# Altium schematic sheet Photography_Light.SchDoc
size A4; SheetNumber: 1; SheetTotal: 1
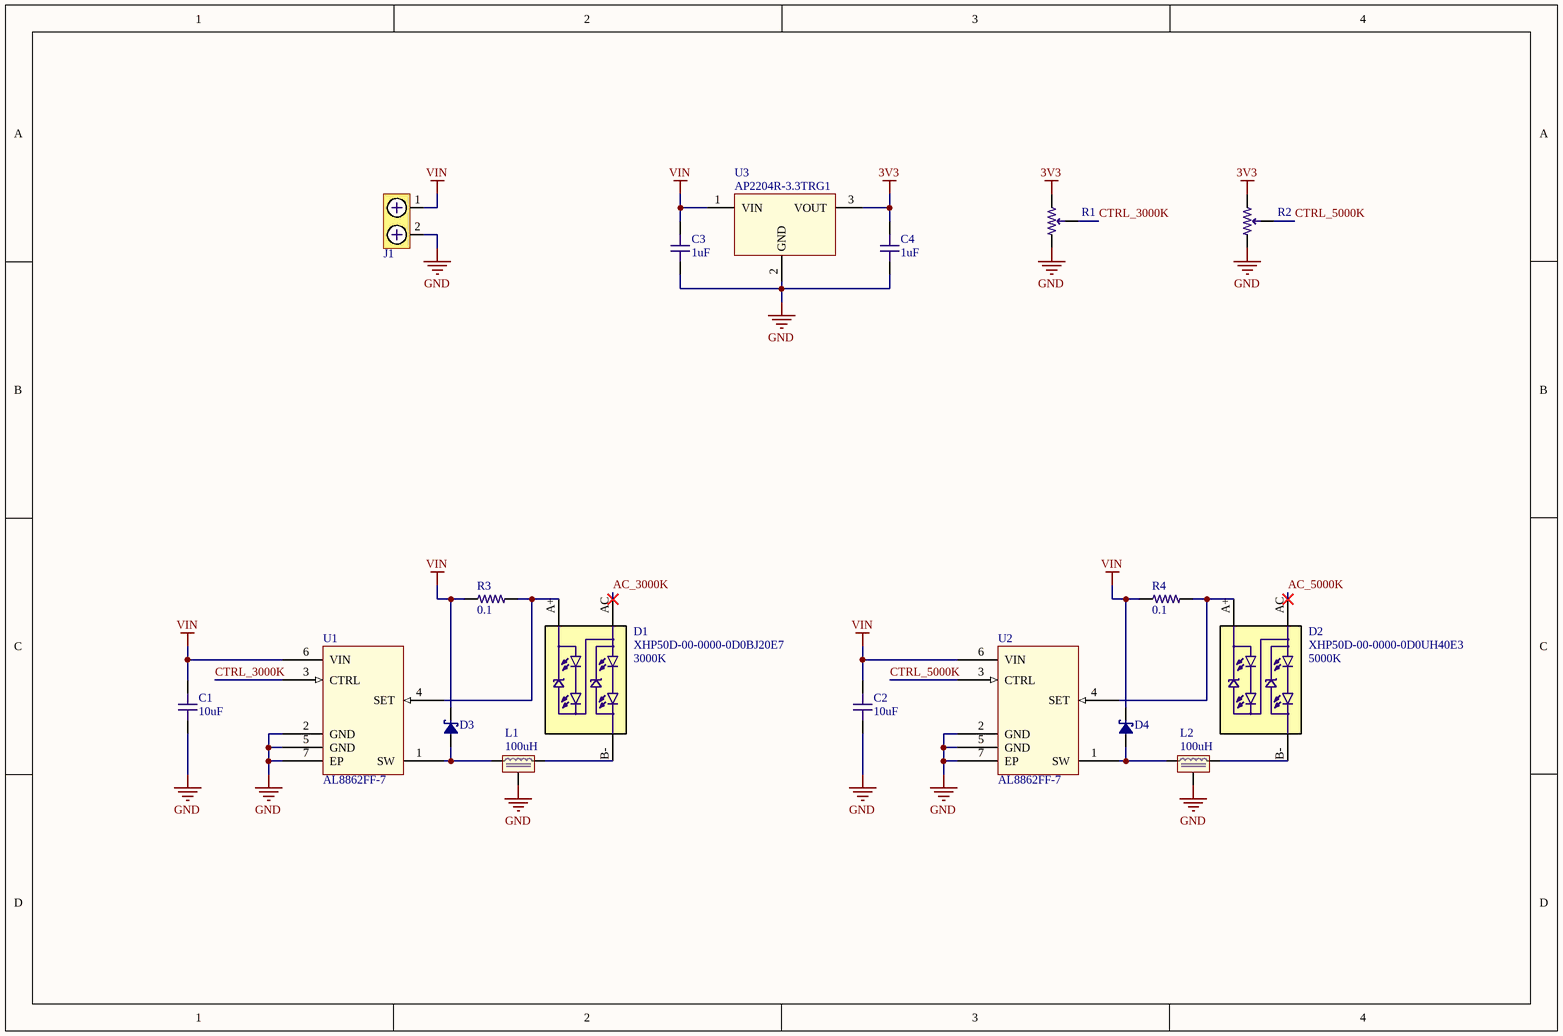
[diagram p0: Photography_Light.SchDoc]

## Parts
C1  value 10uF  [C1206-IPC]  (hidden comment: C1206 10uF 35V X7R)
C2  value 10uF  [C1206-IPC]  (hidden comment: C1206 10uF 35V X7R)
C3  value 1uF  [C0603-IPC]  (hidden comment: C0603 1uF 50V X7R)
C4  value 1uF  [C0603-IPC]  (hidden comment: C0603 1uF 50V X7R)
D1  XHP50D-00-0000-0D0BJ20E7  [LED_XHP50B - 12V Configuration Only]
D2  XHP50D-00-0000-0D0UH40E3  [LED_XHP50B - 12V Configuration Only]
D3  SK56AFL-TP  [DO221AC (SMA-FL)]  (value not drawn)
D4  SK56AFL-TP  [DO221AC (SMA-FL)]  (value not drawn)
J1  Phoenix Contact 1935161  [Phoenix_1935161]  (value not drawn)
L1  value 100uH  [IHLE-5050FH-51]  (hidden comment: IHLE5050FHER101M51)
L2  value 100uH  [IHLE-5050FH-51]  (hidden comment: IHLE5050FHER101M51)
R1  CTRL_3000K  [TRIM_3352T-1-103LF]  (value not drawn)
R2  CTRL_5000K  [TRIM_3352T-1-103LF]  (value not drawn)
R3  value 0.1  [R2512-IPC]  (hidden comment: R2512 0.1R 1%)
R4  value 0.1  [R2512-IPC]  (hidden comment: R2512 0.1R 1%)
U1  AL8862FF-7  [U-DFN3030-6]
U2  AL8862FF-7  [U-DFN3030-6]
U3  AP2204R-3.3TRG1  [SOT-89]

## Nets
3V3: C4.2 R1.3(CW) R2.3(CW) U3.3(VOUT)
GND: C1.1 C2.1 C3.1 C4.1 J1.2 L1.SHIELD L2.SHIELD R1.1(CCW) R2.1(CCW) U1.2(GND) U1.5(GND) U1.7(EP) U2.2(GND) U2.5(GND) U2.7(EP) U3.2(GND)
VIN: C1.2 C2.2 C3.2 D3.K D4.K J1.1 R3.2 R4.2 U1.6(VIN) U2.6(VIN) U3.1(VIN)
AC_3000K: D1.AC
AC_5000K: D2.AC
CTRL_3000K: R1.2(W) U1.3(CTRL)
CTRL_5000K: R2.2(W) U2.3(CTRL)
NetD1_A+: D1.A+ R3.1 U1.4(SET)
NetD1_B-: D1.B- L1.2
NetD2_A+: D2.A+ R4.1 U2.4(SET)
NetD2_B-: D2.B- L2.2
NetD3_A: D3.A L1.1 U1.1(SW)
NetD4_A: D4.A L2.1 U2.1(SW)

## Notes on the sheet
- (near D1) 3000K
- (near D2) 5000K

## Library data of the parts
C1 C2 = C1206 10uF 25V X7R: CAP CER 10UF 35V X7R 1206; EIA Code: X7R; Max. Voltage: 35V; Features: Soft Termination; Supplier 1: Digi-Key; Supplier Part Number 1: CL31B106KLHNNNE
C3 C4 = C0603 1uF 50V X7R: CAP CER 1UF 50V X7R 0603; EIA Code: X7R; Max. Voltage: 50V
D1 = XHP50D-00-0000-0D0BJ20E7: 3000K LED Lighting series White, Warm 3000K 11.2V 700mA 120° 2020 (5050 Metric); MF: Cree Inc.; MP: XHP50D-00-0000-0D0BJ20E7; Supplier 1: Digi-Key; Supplier Part Number 1: 90-XHP50D-00-0000-0D0BJ20E7CT-ND; Supplier 2: Mouser; Supplier Part Number 2: 941-XHP50D00D0BJ20E7
D2 = XHP50D-00-0000-0D0UH40E3: 5000K LED Lighting series White, Cool 5000K 11.2V 700mA 120° 2020 (5050 Metric); MF: Cree Inc.; MP: XHP50D-00-0000-0D0UH40E3; Supplier 1: Digi-Key; Supplier Part Number 1: 90-XHP50D-00-0000-0D0UH40E3CT-ND; Supplier 2: Mouser; Supplier Part Number 2: 941-XHP50D00D0UH40E3
D3 D4 = SK56AFL-TP: Diode Schottky 60 V 5A Surface Mount DO-221AC (SMA-FL); Supplier 1: Digi-Key; Supplier 2: Mouser; Supplier Part Number 1: SK56AFL-TPMSCT-ND; Supplier Part Number 2: 833-SK56AFL-TP
J1 = Term Block 2pos: Terminal Block, 2 Position, 5mm pitch, 18A, 300V, 12-26 AWG; Manufacturer: Phoenix Contact; Manufacturer Part Number: 1935161; Supplier 1: Digi-Key; Supplier Part Number 1: 277-1667-ND
L1 L2 = IHLE-5050FH-51: 100 µH Shielded Wirewound Inductor 3.1 A 205mOhm Max Nonstandard; Saturation Current: 4.3 A; Supplier 1: Digi-Key; Supplier 2: Mouser; Supplier Part Number 1: 541-IHLE5050FHER101M51CT-ND; Supplier Part Number 2: 70-IHLE5050FHR101M51
R1 R2 = RPot 10k Thumbwheel: 10 kOhms 0.5W, 1/2W Through Hole Thumbwheel Potentiometer Top Adjustment; Supplier 1: Digi-Key; Supplier 2: Mouser; Supplier Part Number 1: 3352T-103LF-ND; Supplier Part Number 2: 652-3352T-1-103LF
R3 R4 = R2512 0.1R 1%: Chip Resistor, 2512, 0.1 ohms, 3W; Supplier 1: Digi-Key; Supplier Part Number 1: 696-1842-1-ND
U1 U2 = AL8862FF-7: LED Driver IC 1 Output DC DC Regulator Step-Down (Buck) Analog, PWM Dimming 1A 6-DFN (3x3); Supplier 1: Digi-Key; Supplier 2: Mouser; Supplier Part Number 1: 31-AL8862FF-7CT-ND; Supplier Part Number 2: 621-AL8862FF-7
U3 = AP2204R-3.3TRG1: Fixed 24V 3.3V 150mA SOT-89(SOT-89-3) Low Dropout Regulators(LDO); Supplier 1: Digi-Key; Supplier 2: Mouser; Supplier 3: LCSC; Supplier Part Number 1: AP2204R-3.3TRG1DICT-ND; Supplier Part Number 2: 621-AP2204R-3.3TRG1; Supplier Part Number 3: C156303